# Altium schematic sheet SYSTEM_BLOCK.SchDoc: SYSTEM BLOCK
size A4; SheetNumber: 2; SheetTotal: 6
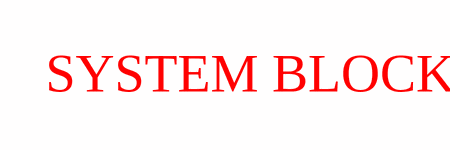
[diagram p0: SYSTEM_BLOCK.SchDoc]

## Notes on the sheet
- SYSTEM BLOCK